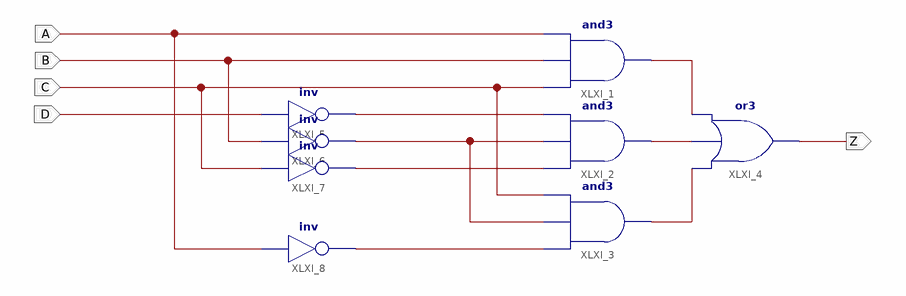
[diagram p0: schematic sheet 1]
// Xilinx ISE schematic p1ej1a.sch (spartan3) as structural Verilog: 8 symbols, 5 ports
module p1ej1a (
  input  A,
  input  D,
  input  B,
  input  C,
  output Z
);

  wire XLXN_4, XLXN_9, XLXN_10, XLXN_12, XLXN_13, XLXN_14, XLXN_15;

  and XLXI_1 (XLXN_13, C, B, A);
  and XLXI_2 (XLXN_14, XLXN_10, XLXN_9, XLXN_4);
  and XLXI_3 (XLXN_15, XLXN_12, XLXN_9, C);
  or XLXI_4 (Z, XLXN_15, XLXN_14, XLXN_13);
  not XLXI_5 (XLXN_4, D);
  not XLXI_6 (XLXN_9, B);
  not XLXI_7 (XLXN_10, C);
  not XLXI_8 (XLXN_12, A);
endmodule
